# EAGLE design schematics (EAGLE 7.5.0)
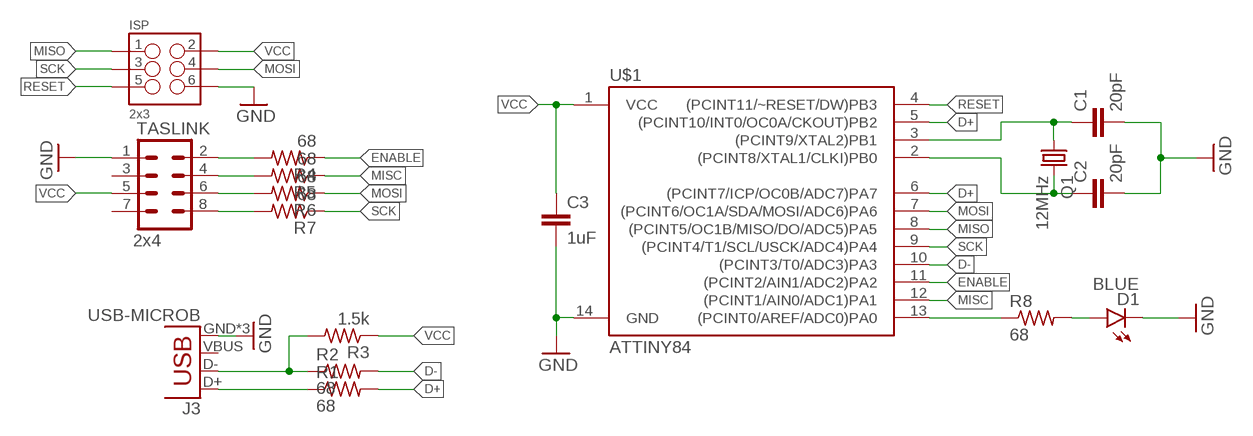
[diagram p0: schematic, sheet 1]

## Parts
C1  20pF  C-EUC0603  [C0603]
C2  20pF  C-EUC0603  [C0603]
C3  1uF  C-EUC0603  [C0603]
D1  BLUE  LED-BLUE0603  [LED-0603]
ISP  2x3  M03X2POGO_PINS  [2X3_POGO]
J3  USB-MICROB  [USB-MICROB]
Q1  12MHz  CRYSTALCTS406  [CTS406]
R1  68  R-US_R0603  [R0603]
R2  68  R-US_R0603  [R0603]
R3  1.5k  R-US_R0603  [R0603]
R4  68  R-US_R0603  [R0603]
R5  68  R-US_R0603  [R0603]
R6  68  R-US_R0603  [R0603]
R7  68  R-US_R0603  [R0603]
R8  68  R-US_R0603  [R0603]
TASLINK  2x4  M04X2  [2X4]
U$1  ATTINY84  [SO14]

## Nets
D+: R1.2 U$1.5((PCINT10/INT0/OC0A/CKOUT)PB2) U$1.6((PCINT7/ICP/OC0B/ADC7)PA7)
D-: R2.2 U$1.10((PCINT3/T0/ADC3)PA3)
ENABLE: R4.1 U$1.11((PCINT2/AIN1/ADC2)PA2)
GND: C1.2 C2.2 C3.2 D1.C ISP.P$6 J3.GND J3.MT1(GND) J3.MT2(GND) TASLINK.1 U$1.14(GND)
LED: R8.1 U$1.13((PCINT0/AREF/ADC0)PA0)
MISC: R5.1 U$1.12((PCINT1/AIN0/ADC1)PA1)
MISO: ISP.P$1 U$1.8((PCINT5/OC1B/MISO/DO/ADC5)PA5)
MOSI: ISP.P$4 R6.1 U$1.7((PCINT6/OC1A/SDA/MOSI/ADC6)PA6)
N$1: C1.1 Q1.1 U$1.3((PCINT9/XTAL2)PB1)
N$2: C2.1 Q1.3 U$1.2((PCINT8/XTAL1/CLKI)PB0)
N$3: J3.D+ R1.1
N$4: J3.D- R2.1 R3.2
N$5: D1.A R8.2
N$6: R7.2 TASLINK.8
N$8: R6.2 TASLINK.6
N$9: R5.2 TASLINK.4
N$10: R4.2 TASLINK.2
RESET: ISP.P$5 U$1.4((PCINT11/~RESET/DW)PB3)
SCK: ISP.P$3 R7.1 U$1.9((PCINT4/T1/SCL/USCK/ADC4)PA4)
VCC: C3.1 ISP.P$2 R3.1 TASLINK.5 U$1.1(VCC)
Unconnected: J3.VBUS TASLINK.3 TASLINK.7

## Library data of the parts
C1-C3 = resistor:C-EU: CAPACITOR, European symbol
D1 = SparkFun-LED:LED-BLUE: Blue LEDs for production use Various blue LEDs stocked by SparkFun production 0603 - DIO-08575 Rebel - DIO-09553 1206 - DIO-09911; PROD_ID: DIO-08575
ISP = SparkFun-Connectors:M03X2: 2x3 .1" header. Shrouded, with keying- CONN-10681 SMT- CONN-11415 Pogo pins- HW-11044; PROD_ID: HW-11044
J3 = SparkFun-Connectors:USB: USB Connectors USB-B-PTH is fully proven SKU : PRT-00139/CONN-08278 USB-miniB is fully proven SKU : PRT-00587 USB-A-PCB is untested. USB-A-H is throughly reviewed, but untested. Spark Fun Electronics SKU : PRT-00437 USB-B-SMT is throughly reviewed, but untested. Needs silkscreen touching up. USB-A-S has not been used/tested USB-MB-H has not been used/tested USB-MICROB has been used. CONN-09505; PROD_ID: CONN-09505
Q1 = crystal:CRYSTAL: CRYSTAL; OC_FARNELL: unknown; OC_NEWARK: unknown
R1-R8 = resistor:R-US_: RESISTOR, American symbol
TASLINK = SparkFun-Connectors:M04X2: .1" header, two rows of four.
U$1 = SparkFun-DigitalIC:ATTINY84: Atmel 14-pin 2/4/8kB flash uC; PROD_ID: IC-11285

## Board
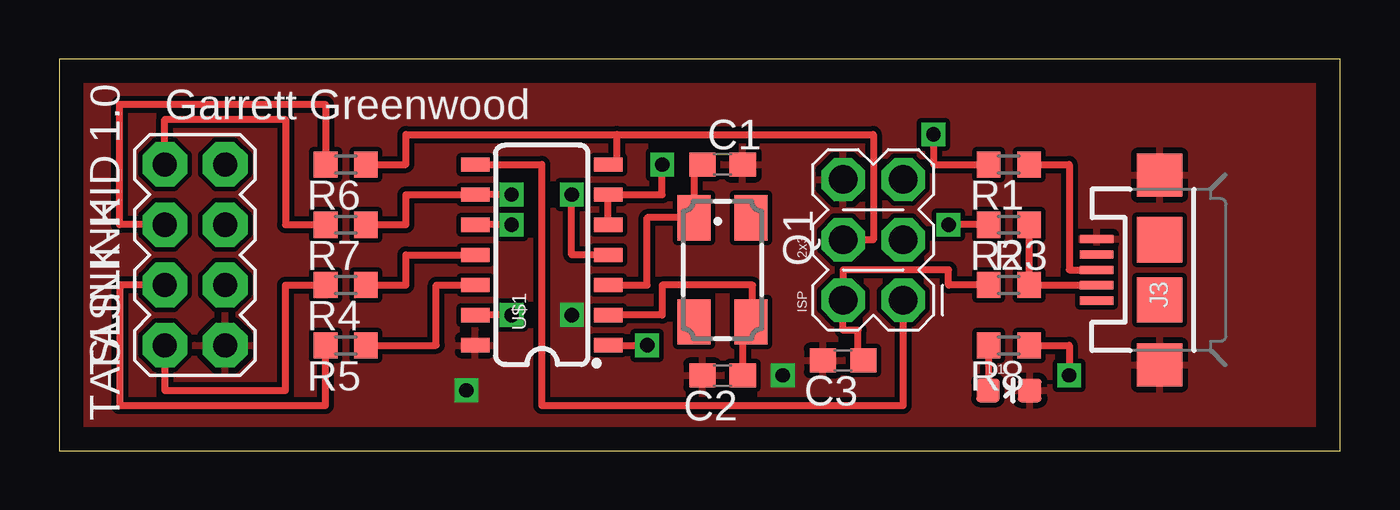
[diagram p1: board, top side]
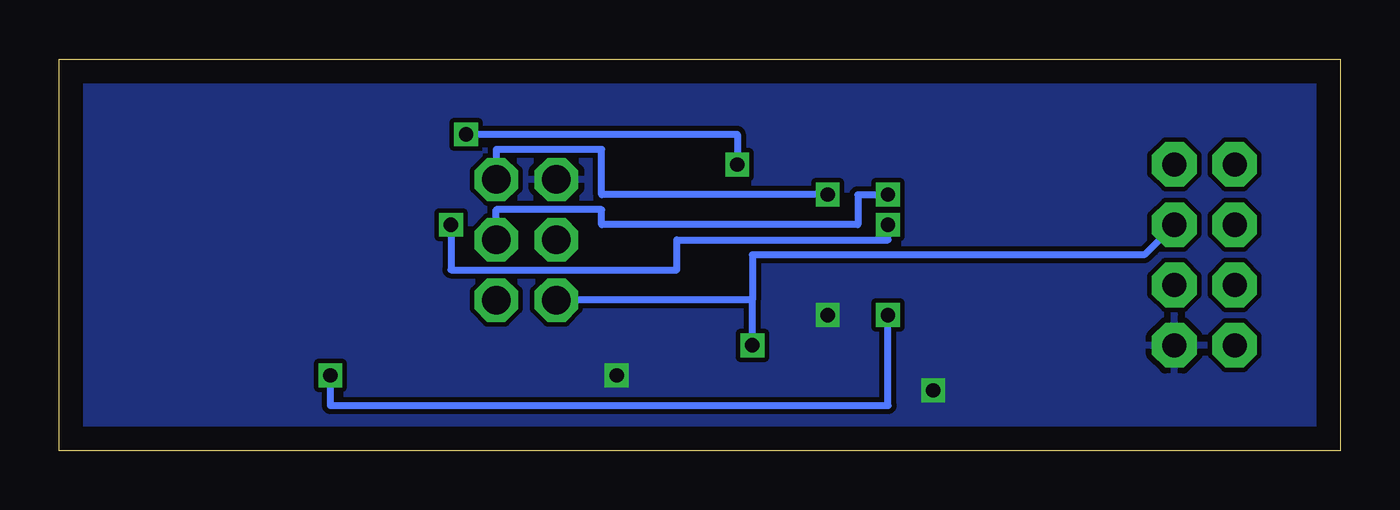
[diagram p2: board, bottom side, seen from below]

Size 53.96 x 16.5 mm. Coordinates in mm from the lower left corner, seen from the top.
Outline: 0,0 53.96,0 53.96,16.5 0,16.5 0,0
Copper layers (1*16): Top 0.035mm / dielectric 1.5mm / Bottom 0.035mm
Design rules "default": minimum track width 10mil, minimum drill 24mil, track to track 8mil, track to pad 8mil, pad to pad 8mil, via to via 8mil, smd to smd 8mil, copper to edge 40mil, drill to drill 8mil, minimum pad ring 10mil, minimum via ring 8mil, stop-mask expansion 4mil, vias tented up to drill 0mil, thermal gap 10mil

### Footprints (pad centres in the part's own frame; a part is rotated, then mirrored left to right if it is on the bottom)
C0603 = smd 1.1 x 1: 1 -0.85,0; 2 0.85,0
LED-0603 = smd 1 x 1: A 0,-0.877; C 0,0.877
2X3_POGO = drill 1.2 pad 1.829 octagon: P$1 0,0; P$2 0,2.54; P$3 2.54,0; P$4 2.54,2.54; P$5 5.08,0; P$6 5.08,2.54
USB-MICROB = smd 0.35 x 1.4: D+ 0,2.65; D- -0.65,2.65; GND 1.3,2.65; ID 0.65,2.65; VBUS -1.3,2.65 | smd 1.8 x 1.9: MT1 -4,0; MT2 4,0 | smd 1.9 x 1.9: P$1 -1.27,0; P$2 1.27,0
CTS406 = smd 1.9 x 1.4: 1 -2.2,-1.2; 2 2.2,-1.2; 3 2.2,1.2; 4 -2.2,1.2
R0603 = smd 1 x 1.1: 1 -0.85,0; 2 0.85,0
2X4 = drill 1.016 pad 1.88 octagon: 1 -3.81,-1.27; 2 -3.81,1.27; 3 -1.27,-1.27; 4 -1.27,1.27; 5 1.27,-1.27; 6 1.27,1.27; 7 3.81,-1.27; 8 3.81,1.27
SO14 = smd 0.6 x 1.2: 1 -3.81,-2.8; 2 -2.54,-2.8; 3 -1.27,-2.8; 4 0,-2.8; 5 1.27,-2.8; 6 2.54,-2.8; 7 3.81,-2.8; 8 3.81,2.8; 9 2.54,2.8; 10 1.27,2.8; 11 0,2.8; 12 -1.27,2.8; 13 -2.54,2.8; 14 -3.81,2.8

### Placement (x,y rotation side)
C1  27.94,12.06 0 top
C2  27.94,3.17 180 top
C3  33.02,3.81 180 top
D1  40.01,2.54 270 top
ISP  35.56,6.35 90 top
J3  46.35,7.62 90 top
Q1  27.94,7.62 270 top
R1  40.01,12.06 180 top
R2  40.01,9.53 180 top
R3  40.01,6.99 0 top
R4  12.06,6.99 180 top
R5  12.06,4.45 180 top
R6  12.06,12.06 180 top
R7  12.06,9.53 180 top
R8  40.01,4.45 180 top
TASLINK  5.71,8.26 90 top
U$1  20.32,8.26 90 top

### Tracks (layer width: path | path; a pad name or v marks a point on that pad's centre or on a via)
D+  (via drill 0.6)
  Top 0.305: U$1.5 U$1.6 25.4,10.79 v25.4,12.06 | v36.83,13.34 36.83,12.06 R1.2
  Bottom 0.305: v25.4,12.06 25.4,13.34 v36.83,13.34
D-  (via drill 0.6)
  Top 0.305: R2.2 v37.47,9.53 | v19.05,9.53 U$1.10
  Bottom 0.305: v37.47,9.53 37.47,7.62 27.94,7.62 27.94,8.89 19.05,8.89 v19.05,9.53
ENABLE
  Top 0.305: R4.1 14.61,6.99 14.61,8.26 U$1.11
GND  (via drill 0.6)
  Top 0.305: U$1.14 17.78,4.45
  other vias: 17.14,2.54 21.59,5.71 30.48,3.17
  pour Top: 0,16.51 53.98,16.51 53.98,0 0,0
  pour Bottom: 0,16.51 0,0 53.98,0 53.98,16.51
LED  (via drill 0.6)
  Top 0.305: v19.05,5.71 U$1.13 | R8.1 42.55,4.45 v42.55,3.17
  Bottom 0.305: v42.55,3.17 42.55,1.91 19.05,1.91 v19.05,5.71
MISC
  Top 0.305: R5.1 15.88,4.45 15.88,6.99 U$1.12
MISO
  Top 0.305: U$1.8 20.32,12.06 20.32,1.91 35.56,1.91 ISP.P$1
MOSI
  Top 0.305: R6.1 14.61,12.06 14.61,13.34 23.5,13.34 | 23.5,13.34 34.29,13.34 34.29,8.89 ISP.P$4 | 22.86,12.06 23.5,12.06 23.5,13.34
  Top 0.406: 22.86,12.06 U$1.7
N$1
  Top 0.305: U$1.3 24.77,6.99 24.77,9.82 Q1.1 26.74,12.06 C1.1
  Top 0.406: C1.1 27.38,12.06
N$2
  Top 0.305: 29.21,5.42 29.21,6.99 25.4,6.99 25.4,5.71 U$1.2 | Q1.3 28.79,5.42 C2.1
  Top 0.406: Q1.3 29.21,5.42
N$3
  Top 0.305: R1.1 42.55,12.06 42.55,7.62 J3.D+
N$4
  Top 0.305: J3.D- 40.85,6.97 R3.2 R2.1
N$5
  Top 0.305: R8.2 D1.A
N$6
  Top 0.305: TASLINK.8 4.45,13.97 9.53,13.97 9.53,9.53 R7.2
N$8
  Top 0.305: TASLINK.6 2.54,9.53 2.54,14.61 11.21,14.61 R6.2
N$9
  Top 0.305: TASLINK.4 2.54,6.99 2.54,1.91 11.21,1.91 R5.2
N$10
  Top 0.305: TASLINK.2 4.45,2.54 9.53,2.54 9.53,6.99 R4.2
RESET  (via drill 0.6)
  Top 0.305: U$1.4 21.59,8.26 v21.59,10.79
  Bottom 0.305: v21.59,10.79 31.11,10.79 31.11,12.7 35.56,12.7 ISP.P$5
SCK  (via drill 0.6)
  Top 0.305: R7.1 14.61,9.53 14.61,10.79 U$1.9 v19.05,10.79
  Bottom 0.305: v19.05,10.79 20.32,10.79 20.32,9.53 31.11,9.53 31.11,10.16 35.56,10.16 ISP.P$3
VCC  (via drill 0.6)
  Top 0.305: U$1.1 v24.77,4.45 | C3.1 33.66,3.81 33.66,5.08 33.02,5.08 ISP.P$2 33.02,7.62 37.47,7.62 37.47,6.99 R3.1
  Bottom 0.305: TASLINK.5 8.26,8.26 24.77,8.26 24.77,6.35 | 24.77,6.35 ISP.P$2 | v24.77,4.45 24.77,6.35

### Text on the board
tPlace: Garrett Greenwood | TASLINK-HID 1.0